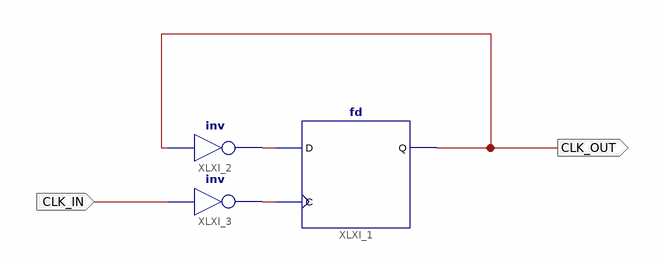
[diagram p0: schematic sheet 1]
// Xilinx ISE schematic DIV2.sch (spartan6) as structural Verilog: 3 symbols, 2 ports
module DIV2 (
  input  CLK_IN,
  output CLK_OUT
);

  wire XLXN_1, XLXN_2;

  fd XLXI_1 (.C(XLXN_2), .D(XLXN_1), .Q(CLK_OUT));
  not XLXI_2 (XLXN_1, CLK_OUT);
  not XLXI_3 (XLXN_2, CLK_IN);
endmodule
